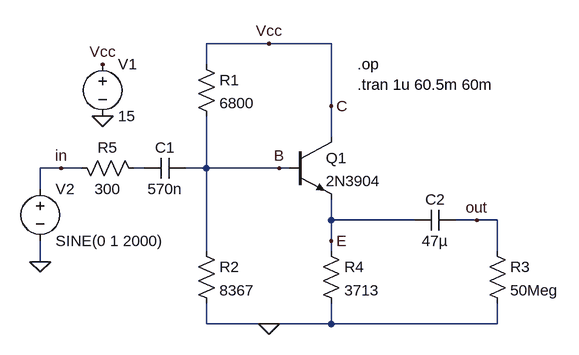
[diagram p0: schematic EF-ckt.asc]
EF-ckt.asc, the LTspice schematic file:
Version 4
SHEET 1 880 680
WIRE 176 32 80 32
WIRE 272 32 176 32
WIRE 80 64 80 32
WIRE 272 128 272 32
WIRE 272 176 272 128
WIRE -144 224 -176 224
WIRE -112 224 -144 224
WIRE -16 224 -32 224
WIRE 80 224 80 144
WIRE 80 224 48 224
WIRE 192 224 80 224
WIRE 208 224 192 224
WIRE -176 256 -176 224
WIRE 272 304 272 272
WIRE 400 304 272 304
WIRE 496 304 464 304
WIRE 528 304 496 304
WIRE 272 336 272 304
WIRE 80 352 80 224
WIRE 272 352 272 336
WIRE 528 352 528 304
WIRE -176 368 -176 336
WIRE 80 464 80 432
WIRE 176 464 80 464
WIRE 272 464 272 432
WIRE 272 464 176 464
WIRE 528 464 528 432
WIRE 528 464 272 464
FLAG -80 144 0
FLAG -80 64 Vcc
FLAG 176 32 Vcc
FLAG 176 464 0
FLAG 192 224 B
FLAG 272 336 E
FLAG 272 128 C
FLAG -176 368 0
FLAG 496 304 out
FLAG -144 224 in
DATAFLAG 368 304 "$"
DATAFLAG 112 224 "$"
SYMBOL voltage -80 48 R0
SYMATTR InstName V1
SYMATTR Value 15
SYMBOL Res 64 48 R0
SYMATTR InstName R1
SYMATTR Value 6800
SYMBOL Res 64 336 R0
SYMATTR InstName R2
SYMATTR Value 8367
SYMBOL Res 256 336 R0
SYMATTR InstName R4
SYMATTR Value 3713
SYMBOL npn 208 176 R0
SYMATTR InstName Q1
SYMATTR Value 2N3904
SYMBOL Cap -16 240 R270
WINDOW 0 32 32 VTop 2
WINDOW 3 0 32 VBottom 2
SYMATTR InstName C1
SYMATTR Value 570n
SYMBOL voltage -176 240 R0
SYMATTR InstName V2
SYMATTR Value SINE(0 1 2000)
SYMBOL Cap 400 320 R270
WINDOW 0 32 32 VTop 2
WINDOW 3 0 32 VBottom 2
SYMATTR InstName C2
SYMATTR Value 47µ
SYMBOL Res 512 336 R0
SYMATTR InstName R3
SYMATTR Value 50Meg
SYMBOL Res -128 208 M90
WINDOW 0 0 56 VBottom 2
WINDOW 3 32 56 VTop 2
SYMATTR InstName R5
SYMATTR Value 300
TEXT 312 64 Left 2 !.op\n.tran 1u 60.5m 60m

The netlist it stands for:
* EF-ckt.asc
V1 C 0 15
R1 C B 6800
R2 B 0 8367
R4 E 0 3713
Q1 C B E 0 2N3904
C1 N001 B 570n
V2 in 0 SINE(0 1 2000)
C2 E out 47µ
R3 out 0 50Meg
R5 in N001 300
.model NPN NPN
.model PNP PNP
.lib standard.bjt
.op
.tran 1u 60.5m 60m
.backanno
.end